# EAGLE design interrupter (EAGLE 6.1)
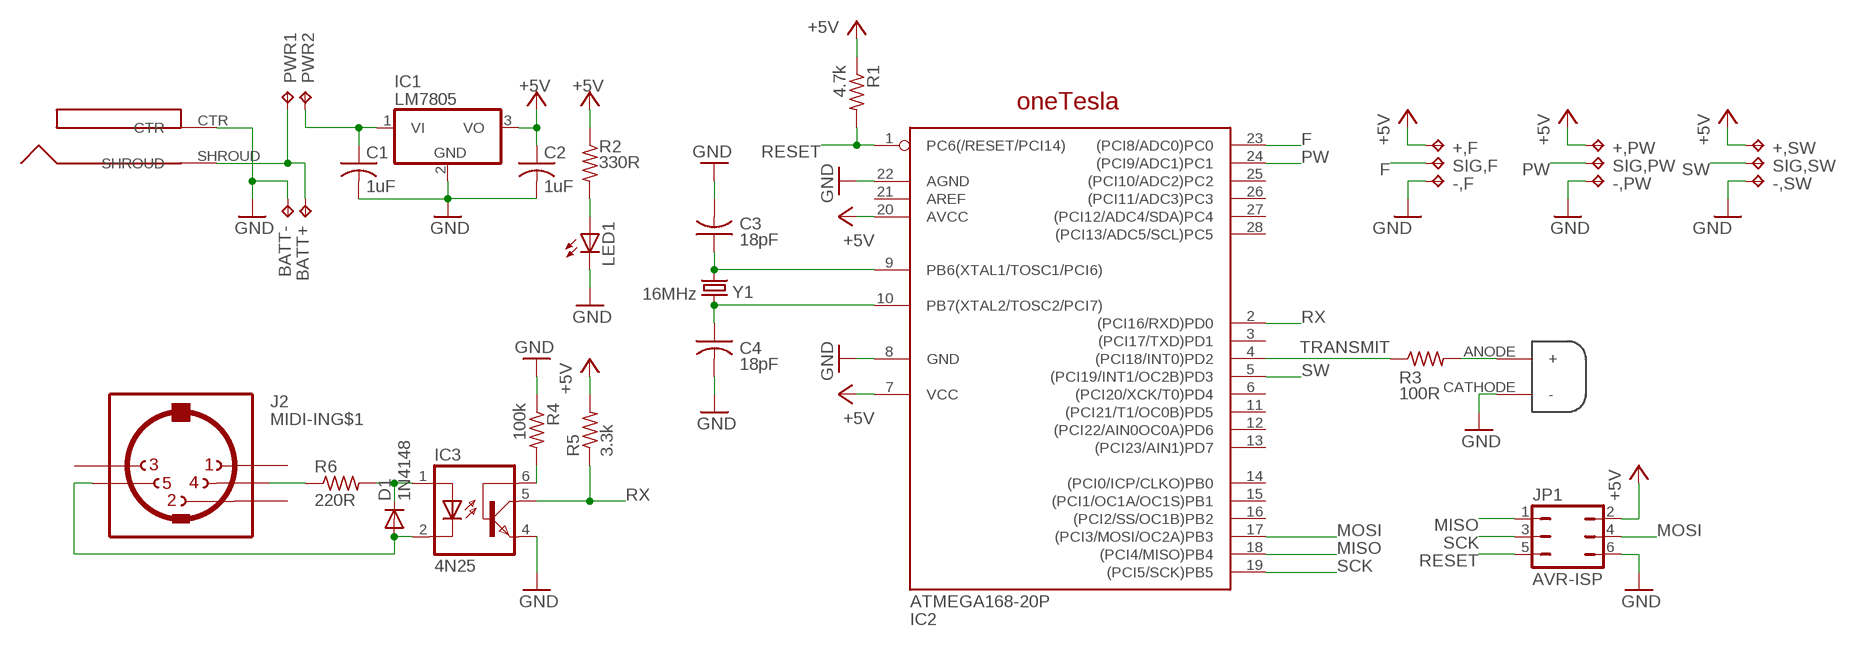
[diagram p0: schematic, sheet 1]

## Parts
+,F  TPPAD1-13  [P1-13]
+,PW  TPPAD1-13  [P1-13]
+,SW  TPPAD1-13  [P1-13]
-,F  TPPAD1-13  [P1-13]
-,PW  TPPAD1-13  [P1-13]
-,SW  TPPAD1-13  [P1-13]
BATT+  TPPAD1-13  [P1-13]
BATT-  TPPAD1-13  [P1-13]
C1  1uF  C-US050-024X044  [C050-024X044]
C2  1uF  C-US050-024X044  [C050-024X044]
C3  18pF  C-US025-024X044  [C025-024X044]
C4  18pF  C-US025-024X044  [C025-024X044]
D1  1N4148  1N4148DO35-7  [DO35-7]
IC1  LM7805  7805T  [TO220H]
IC2  ATMEGA168-20P  [DIL28-3]
IC3  4N25  4N25M  [DIL06]
JP1  AVR-ISP  JP3Q  [JP3Q]
LED1  LED5MM  [LED5MM]
MIDI-IN  J2  MIDIJACK  [CP-2350]
POWER  J1  PJ-037B  [DJC0202]
PWR1  TPPAD1-13  [P1-13]
PWR2  TPPAD1-13  [P1-13]
R1  4.7k  R-US_0207/7  [0207/7]
R2  330R  R-US_0207/7  [0207/7]
R3  100R  R-US_0207/7  [0207/7]
R4  100k  R-US_0207/7  [0207/7]
R5  3.3k  R-US_0207/7  [0207/7]
R6  220R  R-US_0207/7  [0207/7]
SIG,F  TPPAD1-13  [P1-13]
SIG,PW  TPPAD1-13  [P1-13]
SIG,SW  TPPAD1-13  [P1-13]
U$1  LOGO  [LOGO]
U$2  IFE96_OPTO  [IFE96]
Y1  16MHz  CRYSTALHC49UV  [HC49U-V]

## Nets
+5V: +,F.TP +,PW.TP +,SW.TP C2.1 IC1.3(VO) IC2.7(VCC) IC2.20(AVCC) JP1.2 R1.1 R2.1 R5.2
F: IC2.23((PCI8/ADC0)PC0) SIG,F.TP
GND: -,F.TP -,PW.TP -,SW.TP BATT-.TP C1.2 C2.2 C3.2 C4.2 IC1.2(GND) IC2.8(GND) IC2.22(AGND) IC3.4(EMI) JP1.6 LED1.K(C) POWER.CTR R4.1 U$2.CATHODE(-)
MISO: IC2.18((PCI4/MISO)PB4) JP1.1
MOSI: IC2.17((PCI3/MOSI/OC2A)PB3) JP1.4
N$1: D1.C IC3.1(A) R6.2
N$2: D1.A IC3.2(C) MIDI-IN.5
N$3: IC3.6(BAS) R4.2
N$4: C3.1 IC2.9(PB6(XTAL1/TOSC1/PCI6)) Y1.2
N$5: C1.1 IC1.1(VI) PWR2.TP
N$6: MIDI-IN.4 R6.1
N$7: C4.1 IC2.10(PB7(XTAL2/TOSC2/PCI7)) Y1.1
N$8: R3.2 U$2.ANODE(+)
N$9: LED1.A R2.2
N$12: BATT+.TP POWER.SHROUD PWR1.TP
PW: IC2.24((PCI9/ADC1)PC1) SIG,PW.TP
RESET: IC2.1(PC6(/RESET/PCI14)) JP1.5 R1.2
RX: IC2.2((PCI16/RXD)PD0) IC3.5(COL) R5.1
SCK: IC2.19((PCI5/SCK)PB5) JP1.3
SW: IC2.5((PCI19/INT1/OC2B)PD3) SIG,SW.TP
TRANSMIT: IC2.4((PCI18/INT0)PD2) R3.1
Unconnected: IC2.3((PCI17/TXD)PD1) IC2.6((PCI20/XCK/T0)PD4) IC2.11((PCI21/T1/OC0B)PD5) IC2.12((PCI22/AIN0OC0A)PD6) IC2.13((PCI23/AIN1)PD7) IC2.14((PCI0/ICP/CLKO)PB0) IC2.15((PCI1/OC1A/OC1S)PB1) IC2.16((PCI2/SS/OC1B)PB2) IC2.21(AREF) IC2.25((PCI10/ADC2)PC2) IC2.26((PCI11/ADC3)PC3) IC2.27((PCI12/ADC4/SDA)PC4) IC2.28((PCI13/ADC5/SCL)PC5) MIDI-IN.1 MIDI-IN.2 MIDI-IN.3 MIDI-IN.PE1(MT) MIDI-IN.PE2(MT) MIDI-IN.PE(MT) MIDI-IN.PE@(MT)

## Library data of the parts
+,F +,PW +,SW -,F -,PW -,SW BATT+ BATT- PWR1 PWR2 SIG,F SIG,PW SIG,SW = testpad:TP: Test pad
C1-C4 = rcl:C-US: CAPACITOR, American symbol
D1 = diode:1N4148: DIODE high speed (Philips)
IC1 = linear:78*: Positive VOLTAGE REGULATOR Source: http://cache.national.com/ds/LM/LM78L05.pdf http://www.fairchildsemi.com/ds/LM/LM7805.pdf
IC2 = adafruit:ATMEGA168*P: MICROCONTROLLER 16 kBytes FLASH 1 kBytes SRAM 512 Bytes EEPROM USART 8-channel 10 bit ADC
IC3 = optocoupler:4N*?M: General Purpose 6-Pin Phototransistor Optocouplers Source: http://www.fairchildsemi.com/ds/4N/4N35-M.pdf; MPN: 4N25-M; OC_FARNELL: 1021349; OC_NEWARK: 98K9084
JP1 = jumper:JP3Q: JUMPER
LED1 = led:LED: LED OSRAM: - CHIPLED LG R971, LG N971, LY N971, LG Q971, LY Q971, LO R971, LY R971 LH N974, LH R974 LS Q976, LO Q976, LY Q976 LO Q996 - Hyper CHIPLED LW Q18S LB Q993, LB Q99A, LB R99A - SideLED LS A670, LO A670, LY A670, LG A670, LP A670 LB A673, LV A673, LT A673, LW A673 LH A674 LY A675 LS A676, LA A676, LO A676, LY A676, LW A676 LS A679, LY A679, LG A679 - Hyper Micro SIDELED® LS Y876, LA Y876, LO Y876, LY Y876 LT Y87S - SmartLED LW L88C, LW L88S LB L89C, LB L89S, LG L890 LS L89K, LO L89K, LY L89K LS L896, LA L896, LO L896, LY L896 - TOPLED LS T670, LO T670, LY T670, LG T670, LP T670 LSG T670, LSP T670, LSY T670, LOP T670, LYG T670 LG T671, LOG T671, LSG T671 LB T673, LV T673, LT T673, LW T673 LH T674 LS T676, LA T676, LO T676, LY T676, LB T676, LH T676, LSB T676, LW T676 LB T67C, LV T67C, LT T67C, LS T67K, LO T67K, LY T67K, LW E67C LS E67B, LA E67B, LO E67B, LY E67B, LB E67C, LV E67C, LT E67C LW T67C LS T679, LY T679, LG T679 LS T770, LO T770, LY T770, LG T770, LP T770 LB T773, LV T773, LT T773, LW T773 LH T774 LS E675, LA E675, LY E675, LS T675 LS T776, LA T776, LO T776, LY T776, LB T776 LHGB T686 LT T68C, LB T68C - Hyper Mini TOPLED® LB M676 - Mini TOPLED Santana® LG M470 LS M47K, LO M47K, LY M47K Source: http://www.osram.convergy.de LUXEON: - LUMILED® LXK2-PW12-R00, LXK2-PW12-S00, LXK2-PW14-U00, LXK2-PW14-V00 LXK2-PM12-R00, LXK2-PM12-S00, LXK2-PM14-U00 LXK2-PE12-Q00, LXK2-PE12-R00, LXK2-PE12-S00, LXK2-PE14-T00, LXK2-PE14-U00 LXK2-PB12-K00, LXK2-PB12-L00, LXK2-PB12-M00, LXK2-PB14-N00, LXK2-PB14-P00, LXK2-PB14-Q00 LXK2-PR12-L00, LXK2-PR12-M00, LXK2-PR14-Q00, LXK2-PR14-R00 LXK2-PD12-Q00, LXK2-PD12-R00, LXK2-PD12-S00 LXK2-PH12-R00, LXK2-PH12-S00 LXK2-PL12-P00, LXK2-PL12-Q00, LXK2-PL12-R00 Source: www.luxeon.com KINGBRIGHT: KA-3528ASYC Source: www.kingbright.com
MIDI-IN = adafruit:MIDIJACK: DIN 5 jack also known as MIDI jack A modification of conn-hirshman:MAB5SH with two options for the grounding 'teeth'
POWER = onecoil:PJ-037B
R1-R6 = rcl:R-US_: RESISTOR, American symbol
U$1 = onecoil with logo:LOGO
U$2 = tc's LIB:IFE96_OPTO
Y1 = SparkFun:CRYSTAL: Crystals Various standard crystals. Proven footprints. Spark Fun Electronics SKU : COM-00534

## Board
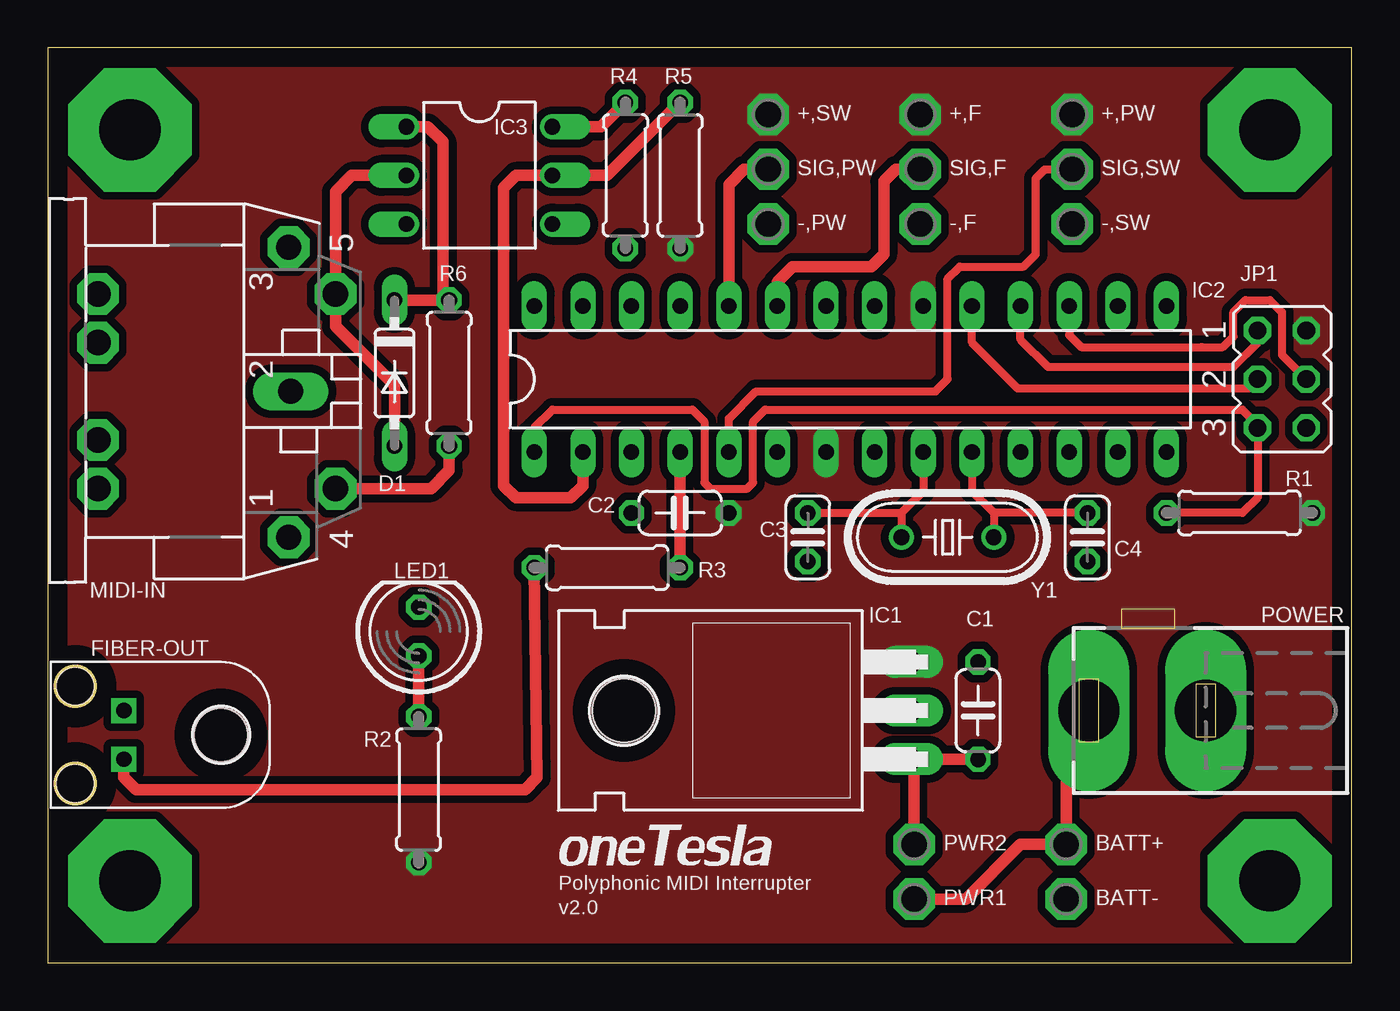
[diagram p1: board, top side]
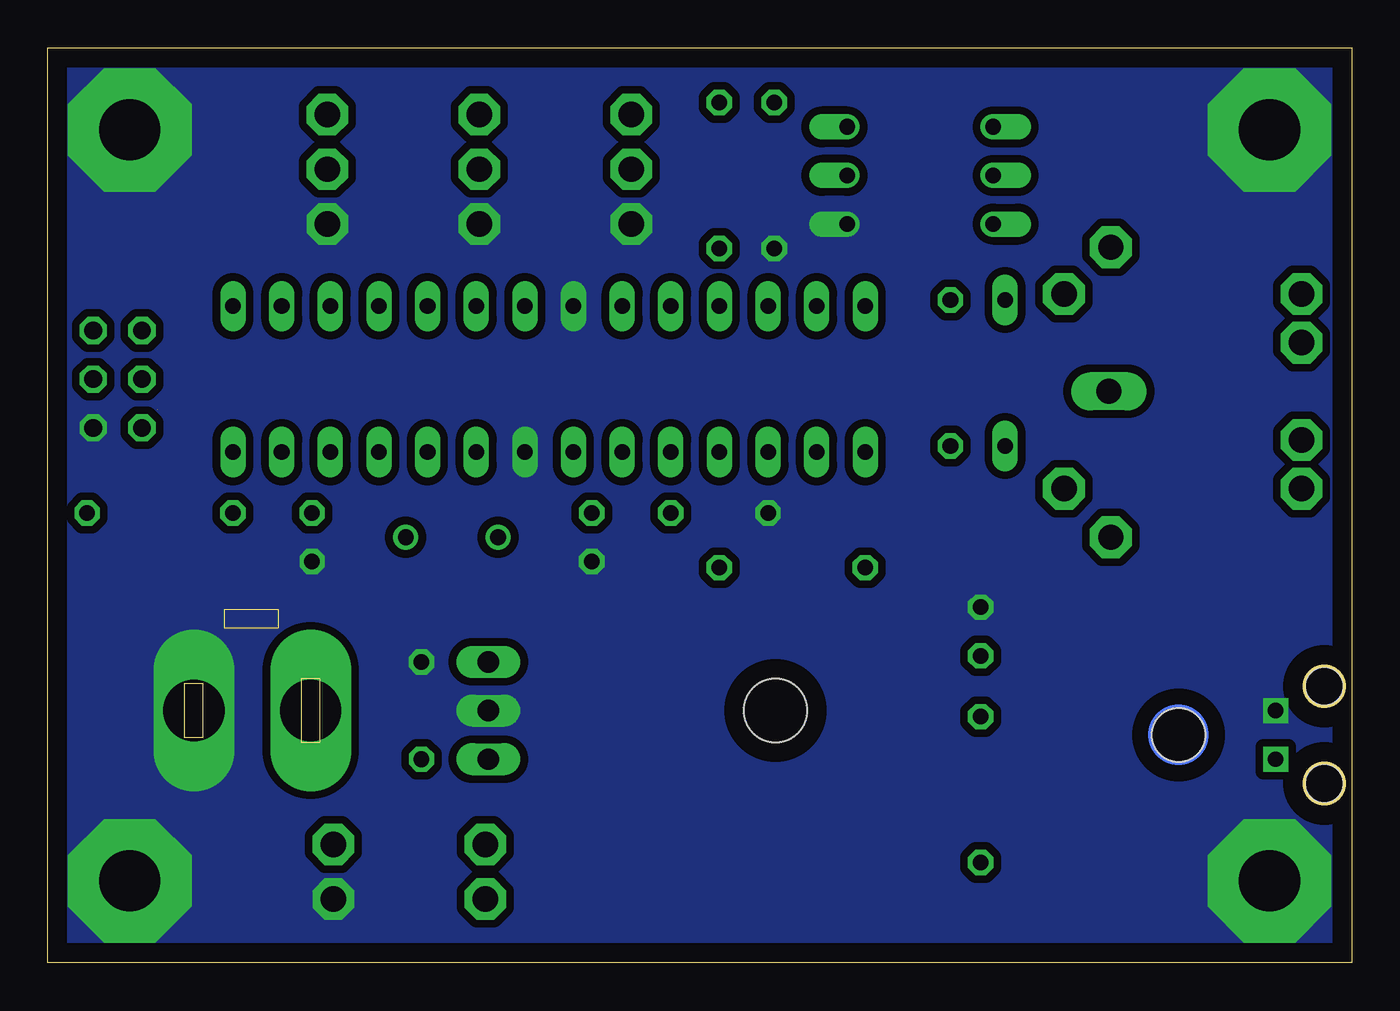
[diagram p2: board, bottom side, seen from below]

Size 68.09 x 47.77 mm. Coordinates in mm from the lower left corner, seen from the top.
Outline: 0,0 68.09,0 68.09,47.77 0,47.77 0,0
Copper layers (1*16): Top 0.035mm / dielectric 1.5mm / Bottom 0.035mm
Design rules: minimum track width 10mil, minimum drill 24mil, track to track 16mil, track to pad 16mil, pad to pad 16mil, via to via 16mil, smd to smd 16mil, copper to edge 40mil, drill to drill 8mil, minimum pad ring 10mil, minimum via ring 8mil, stop-mask expansion 4mil, vias tented up to drill 0mil, thermal gap 10mil
Holes 2.8 mm at 9.05,11.91
Holes 2 mm at 1.43,14.45 1.43,9.37

### Footprints (pad centres in the part's own frame; a part is rotated, then mirrored left to right if it is on the bottom)
P1-13 = drill 1.321 pad 2.159 octagon: TP 0,0
C050-024X044 = drill 0.813 octagon: 1 -2.54,0; 2 2.54,0
C025-024X044 = drill 0.813 octagon: 1 -1.27,0; 2 1.27,0
DO35-7 = drill 0.813 long: A 3.81,0; C -3.81,0
TO220H = drill 1.118 long: 1 -2.54,-10.16; 2 0,-10.16; 3 2.54,-10.16 | hole 3.302: 0,4.826
DIL28-3 = drill 0.813 long: 1 -16.51,-3.81; 2 -13.97,-3.81; 3 -11.43,-3.81; 4 -8.89,-3.81; 5 -6.35,-3.81; 6 -3.81,-3.81; 7 -1.27,-3.81; 8 1.27,-3.81; 9 3.81,-3.81; 10 6.35,-3.81; 11 8.89,-3.81; 12 11.43,-3.81; 13 13.97,-3.81; 14 16.51,-3.81; 15 16.51,3.81; 16 13.97,3.81; 17 11.43,3.81; 18 8.89,3.81; 19 6.35,3.81; 20 3.81,3.81; 21 1.27,3.81; 22 -1.27,3.81; 23 -3.81,3.81; 24 -6.35,3.81; 25 -8.89,3.81; 26 -11.43,3.81; 27 -13.97,3.81; 28 -16.51,3.81
DIL06 = drill 0.813 offset: 1 -2.54,-3.81; 2 0,-3.81; 3 2.54,-3.81; 4 2.54,3.81; 5 0,3.81; 6 -2.54,3.81
JP3Q = drill 0.914 octagon: 1 -2.54,-1.27; 2 -2.54,1.27; 3 0,-1.27; 4 0,1.27; 5 2.54,-1.27; 6 2.54,1.27
LED5MM = drill 0.813 octagon: A -1.27,0; K 1.27,0
CP-2350 = drill 1.321 pad 2.184 octagon: 1 7.62,12.58; 3 -7.52,12.58; 4 5.08,15.02; 5 -5.08,15.02; PE -2.54,2.62; PE1 -5.08,2.62; PE2 5.08,2.62; PE@ 2.54,2.62 | drill 1.321 long: 2 0,12.68
DJC0202 = drill 3.2 pad 3.81 long: CTR 0,-3; SHROUD 0,3.1
0207/7 = drill 0.813 octagon: 1 -3.81,0; 2 3.81,0
IFE96 = drill 0.8 square: ANODE -1.27,5.08; CATHODE 1.27,5.08
HC49U-V = drill 0.813: 1 -2.413,0; 2 2.413,0

### Placement (x,y rotation side)
+,F  45.56,44.29 0 top
+,PW  53.5,44.29 0 top
+,SW  37.62,44.29 0 top
-,F  45.56,38.58 0 top
-,PW  37.62,38.58 0 top
-,SW  53.5,38.58 0 top
BATT+  53.18,6.19 0 top
BATT-  53.18,3.33 0 top
C1  48.58,13.18 90 top
C2  33.02,23.5 180 top
C3  39.69,22.23 270 top
C4  54.29,22.23 270 top
D1  18.1,30.8 270 top
IC1  34.92,13.18 90 top
IC2  41.91,30.48 0 top
IC3  22.54,41.12 270 top
JP1  64.45,30.48 270 top
LED1  19.37,17.3 90 top
MIDI-IN  0,29.84 270 top
POWER  57.47,13.18 90 top
PWR1  45.24,3.33 0 top
PWR2  45.24,6.19 0 top
R1  62.23,23.5 180 top
R2  19.37,9.05 90 top
R3  29.21,20.64 180 top
R4  30.16,41.12 90 top
R5  33.02,41.12 270 top
R6  20.95,30.8 90 top
SIG,F  45.56,41.43 0 top
SIG,PW  37.62,41.43 0 top
SIG,SW  53.5,41.43 0 top
U$1  26.67,5.08 0 top
U$2  9.05,11.91 90 top
Y1  46.99,22.23 180 top

### Tracks (layer width: path | path; a pad name or v marks a point on that pad's centre or on a via)
+5V
  pour Top (no thermals): 0,47.78 68.1,47.78 67.94,30.96 66.67,30.96 66.67,30 67.94,30 68.1,0 0,0
F
  Top 0.61: SIG,F.TP 44.29,41.43 43.66,40.8 43.66,36.99 43.02,36.35 38.89,36.35 38.1,35.56 IC2.23
GND  (via drill 3.2 pad 6.45)
  other vias: 4.29,4.29 4.29,43.5 63.82,43.5 63.82,4.29
  pour Bottom (no thermals): 0,47.78 68.42,47.78 68.42,0 0,0
MISO
  Top 0.406: IC2.18 50.8,32.54 52.23,31.11 60.17,31.11 61.91,31.11 63.18,32.38 JP1.1
MOSI
  Top 0.406: JP1.4 64.45,31.75 64.45,33.97 63.82,34.61 62.55,34.61 61.91,33.97 61.91,32.7 61.36,32.15 60.24,32.15 53.98,32.15 53.34,32.78 IC2.17
N$1
  Top 0.61: D1.C 20.64,34.61 | 20.64,34.61 R6.2 | IC3.1 19.84,43.66 20.64,42.86 20.64,34.61
N$2
  Top 0.61: IC3.2 15.88,41.12 15.02,40.26 MIDI-IN.5 15.02,33.24 18.1,30.16 D1.A
N$3
  Top 0.61: IC3.6 28.89,43.66 R4.2
N$4
  Top 0.406: C3.1 44.58,23.5 | 44.58,23.5 Y1.2 | IC2.9 45.72,24.64 44.58,23.5
N$5
  Top 0.61: C1.1 IC1.1 45.24,10.48 PWR2.TP
N$6
  Top 0.61: MIDI-IN.4 20,24.77 20.95,25.72 R6.1
N$7
  Top 0.406: C4.1 49.4,23.5 | 49.4,23.5 Y1.1 | IC2.10 48.26,24.64 49.4,23.5
N$8
  Top 0.61: R3.2 25.56,9.68 24.92,9.05 4.6,9.05 3.97,9.68 U$2.ANODE
N$9
  Top 0.61: LED1.A R2.2
N$12
  Top 0.61: POWER.SHROUD 53.18,11.99 BATT+.TP 50.8,6.19 47.94,3.33 PWR1.TP
PW
  Top 0.61: IC2.24 35.56,40.64 36.35,41.43 SIG,PW.TP
RESET  (1 unrouted)
  Top 0.406: IC2.1 25.4,27.94 26.35,28.89 33.66,28.89 34.29,28.26 34.29,25.08 34.61,24.77 36.51,24.77 36.83,25.08 36.83,28.26 37.47,28.89 62.39,28.89 63.18,28.1 JP1.5 63.18,24.29 62.39,23.5 R1.2
RX
  Top 0.61: R5.1 29.21,41.12 IC3.5 24.45,41.12 23.81,40.48 23.81,24.92 24.45,24.29 27.3,24.29 27.94,24.92 IC2.2
SCK
  Top 0.406: IC2.19 48.26,32.38 50.64,30 62.71,30 JP1.3
SW
  Top 0.406: IC2.5 35.56,28.42 36.99,29.84 46.35,29.84 46.99,30.48 46.99,35.72 47.62,36.35 50.96,36.35 51.59,36.99 51.59,40.96 52.07,41.43 SIG,SW.TP
TRANSMIT
  Top 0.61: R3.1 IC2.4

### Text on the board
tNames: FIBER-OUT | Polyphonic MIDI Interrupter | v2.0